# EAGLE design esquema (EAGLE 9.0.0)
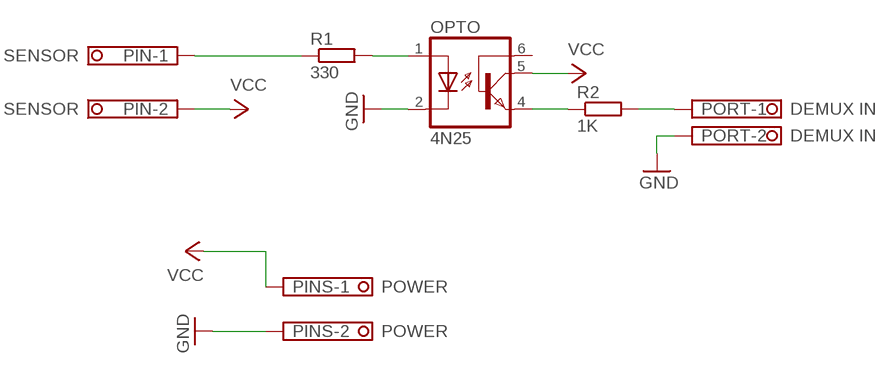
[diagram p0: schematic, sheet 1]

## Parts
OPTO  4N25  CNY17  [DIL06]
PIN  SENSOR  TERMINAL-BLOCK-3.5MM-2-PIN-ROUND-PAD  [TERMINAL-BLOCK-2-PIN-3.5MM-ROUND-PAD]
PINS  POWER  TERMINAL-BLOCK-3.5MM-2-PIN-ROUND-PAD  [TERMINAL-BLOCK-2-PIN-3.5MM-ROUND-PAD]
PORT  DEMUX IN  TERMINAL-BLOCK-3.5MM-2-PIN-ROUND-PAD  [TERMINAL-BLOCK-2-PIN-3.5MM-ROUND-PAD]
R1  330  R-EU_0204/7  [0204/7]
R2  1K  R-EU_0204/7  [0204/7]

## Nets
GND: OPTO.2(C) PINS.2 PORT.2
N$1: OPTO.1(A) R1.2
N$2: OPTO.4(EMI) R2.1
N$3: PORT.1 R2.2
N$4: PIN.1 R1.1
VCC: OPTO.5(COL) PIN.2 PINS.1
Unconnected: OPTO.6(BAS)

## Library data of the parts
OPTO = optocoupler:CNY17: SIEMENS OPTO COUPLER; MPN: CNY17-1; OC_FARNELL: 1045399; OC_NEWARK: 05M4044
PIN PINS PORT = Rembrandt Electronics - Terminal Block 3-5mm v1-0:TERMINAL-BLOCK-3.5MM-2-PIN: Terminal Block 3.5mm Pitch: 3,5 mm Number of pins: 2 Created by Rembrandt Electronics www.rembrandtelectronics.com
R1 R2 = resistor:R-EU_: RESISTOR, European symbol

## Board
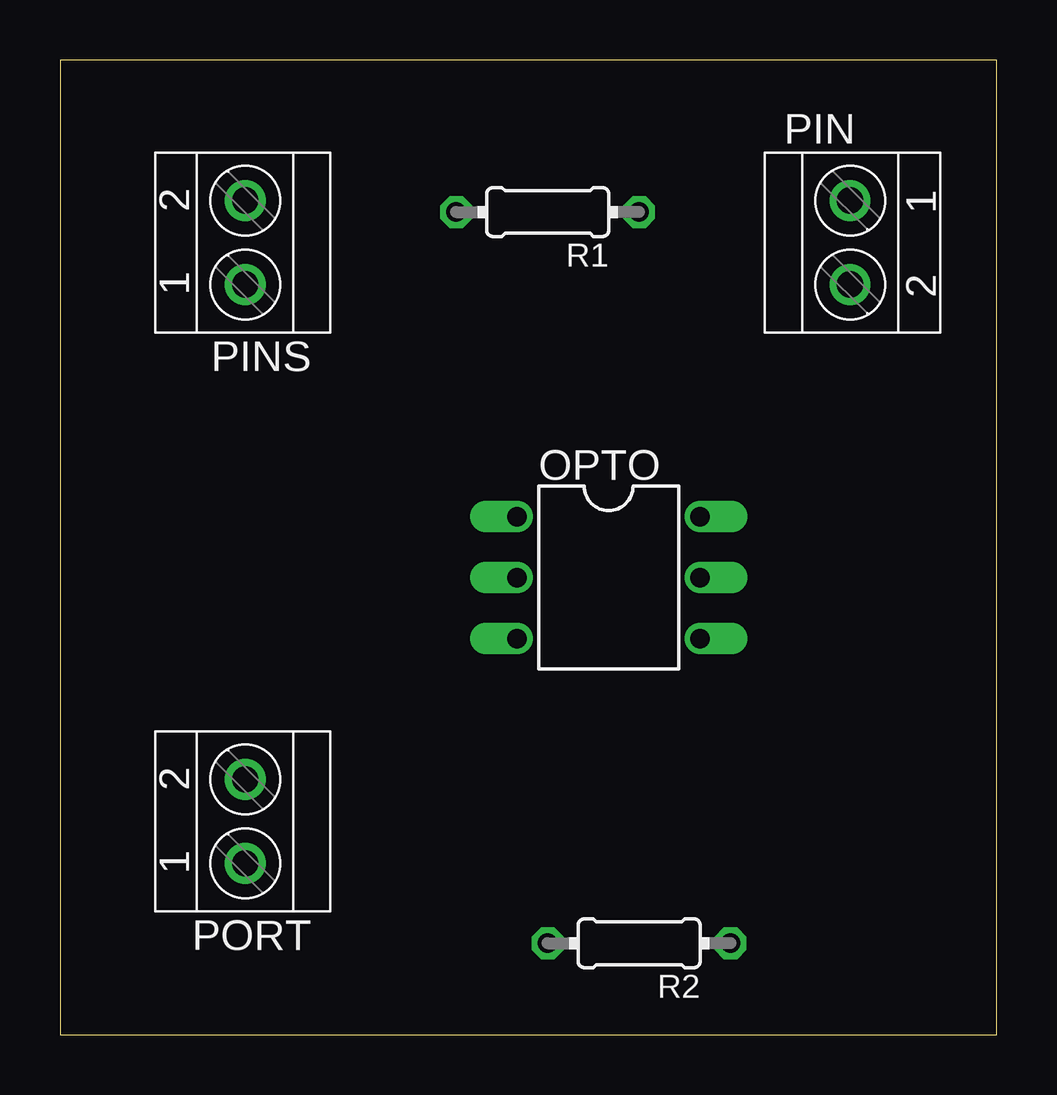
[diagram p1: board, top side]
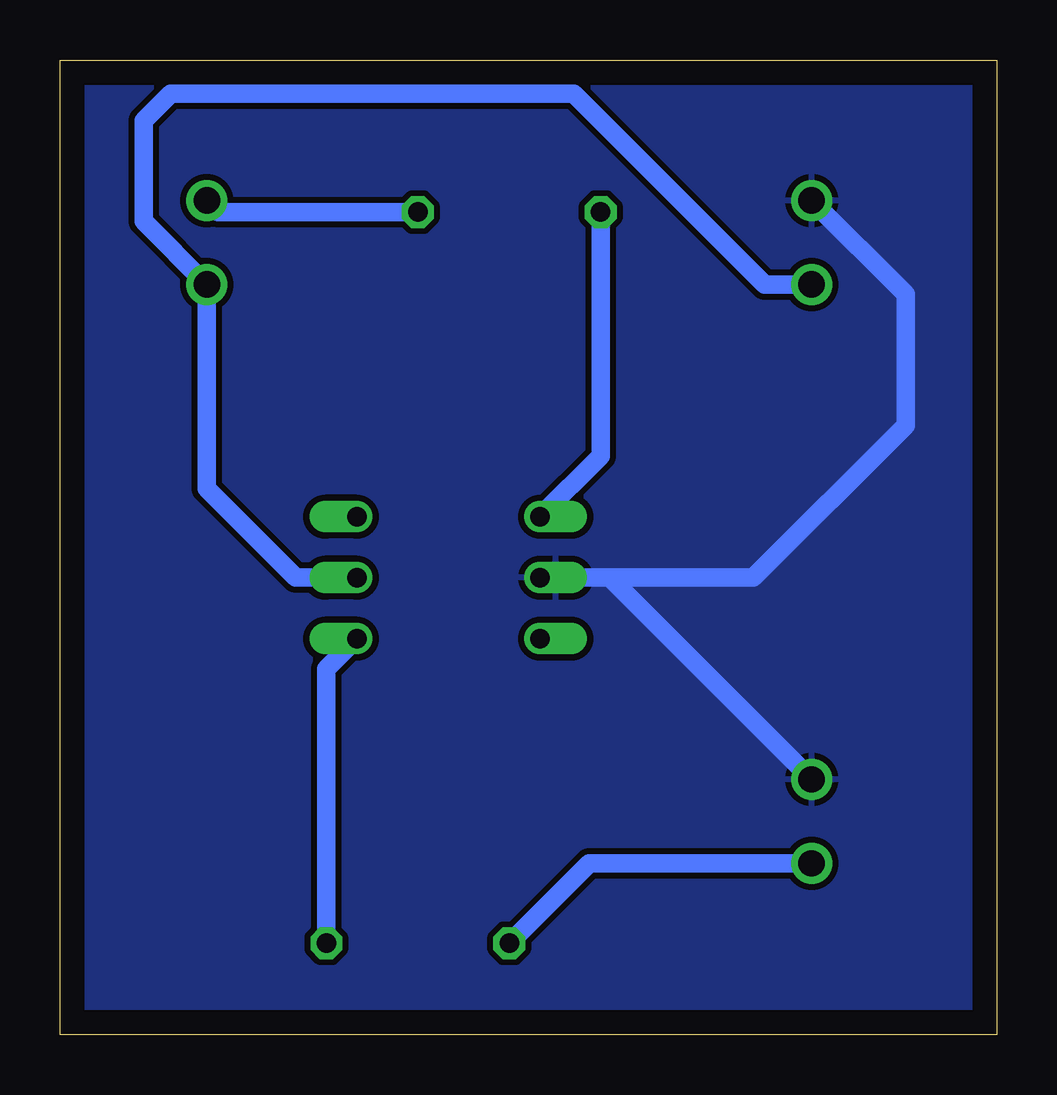
[diagram p2: board, bottom side, seen from below]

Size 39.04 x 40.63 mm. Coordinates in mm from the lower left corner, seen from the top.
Outline: 0,0 39.04,0 39.04,40.63 0,40.63 0,0
Copper layers (1*16): Top 0.035mm / dielectric 1.5mm / Bottom 0.035mm
Design rules "default": minimum track width 6mil, minimum drill 0.35mm, track to track 6mil, track to pad 6mil, pad to pad 6mil, via to via 6mil, smd to smd 6mil, copper to edge 40mil, drill to drill 6mil, minimum pad ring 10mil, minimum via ring 8mil, stop-mask expansion 4mil, vias tented up to drill 0mil, thermal gap 10mil

### Footprints (pad centres in the part's own frame; a part is rotated, then mirrored left to right if it is on the bottom)
DIL06 = drill 0.813 offset: 1 -2.54,-3.81; 2 0,-3.81; 3 2.54,-3.81; 4 2.54,3.81; 5 0,3.81; 6 -2.54,3.81
TERMINAL-BLOCK-2-PIN-3.5MM-ROUND-PAD = drill 1.1 pad 1.7: 1 -1.75,-0.1; 2 1.75,-0.1
0204/7 = drill 0.813 octagon: 1 -3.81,0; 2 3.81,0

### Placement (x,y rotation side)
OPTO  22.86,19.05 270 top
PIN  33.02,33.02 270 top
PINS  7.62,33.02 90 top
PORT  7.62,8.89 90 top
R1  20.32,34.29 180 top
R2  24.13,3.81 180 top

### Tracks (layer width: path | path; a pad name or v marks a point on that pad's centre or on a via)
GND
  Bottom 0.762: PORT.2 16.13,19.05 OPTO.2 10.16,19.05 3.81,25.4 3.81,30.86 PINS.2
  pour Bottom (isolate 0.254): 0,40.64 0,0 39.37,0 39.37,40.64
N$1
  Bottom 0.762: R1.2 16.51,24.13 OPTO.1
N$2
  Bottom 0.762: R2.1 27.94,15.24 OPTO.4
N$3
  Bottom 0.762: R2.2 16.99,7.14 PORT.1
N$4
  Bottom 0.762: PIN.1 32.44,34.29 R1.1
VCC
  Bottom 0.762: OPTO.5 29.21,19.05 32.92,22.76 PIN.2 35.56,33.91 35.56,38.1 34.43,39.23 22.86,39.23 | PINS.1 9.68,31.27 17.64,39.23 22.86,39.23 | 22.86,39.23